# Altium project TurbineSpirometerV2.PrjPcb
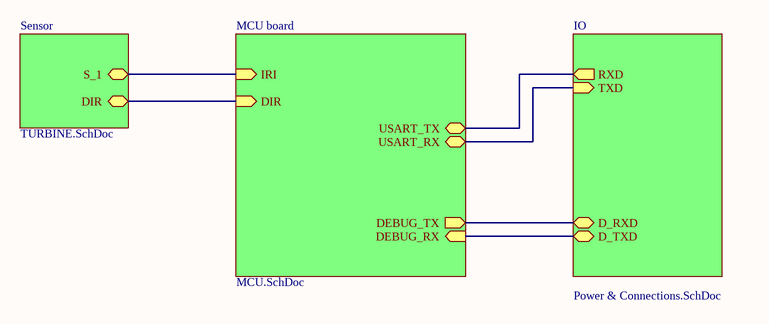
[diagram p0: Turbine_SM.SchDoc]
4 sheets, 52 parts. Net scope: hierarchical (ports join the sheet entries above them; power ports are global).
Board file: MCU.PcbDoc
Sheets:
  Turbine_SM.SchDoc
    Sensor = TURBINE.SchDoc
    MCU board = MCU.SchDoc
    IO = Power & Connections.SchDoc

## Sheet Turbine_SM.SchDoc
size A4

### Sub-sheets
IO = Power & Connections.SchDoc: TXD (in), RXD (out), D_RXD, D_TXD
MCU board = MCU.SchDoc: IRI (in), DIR (in), DEBUG_TX (out), DEBUG_RX (in), USART_TX, USART_RX
Sensor = TURBINE.SchDoc: S_1, DIR

### Nets
NetC3_1: sheet Sensor/S_1, sheet MCU board/IRI
NetJ1_1: sheet MCU board/DEBUG_RX, sheet IO/D_TXD
NetJ1_2: sheet MCU board/DEBUG_TX, sheet IO/D_RXD
NetU2_4: sheet Sensor/DIR, sheet MCU board/DIR
NetU3_30: sheet MCU board/USART_TX, sheet IO/RXD
NetU3_31: sheet MCU board/USART_RX, sheet IO/TXD

## Sheet TURBINE.SchDoc
size A4
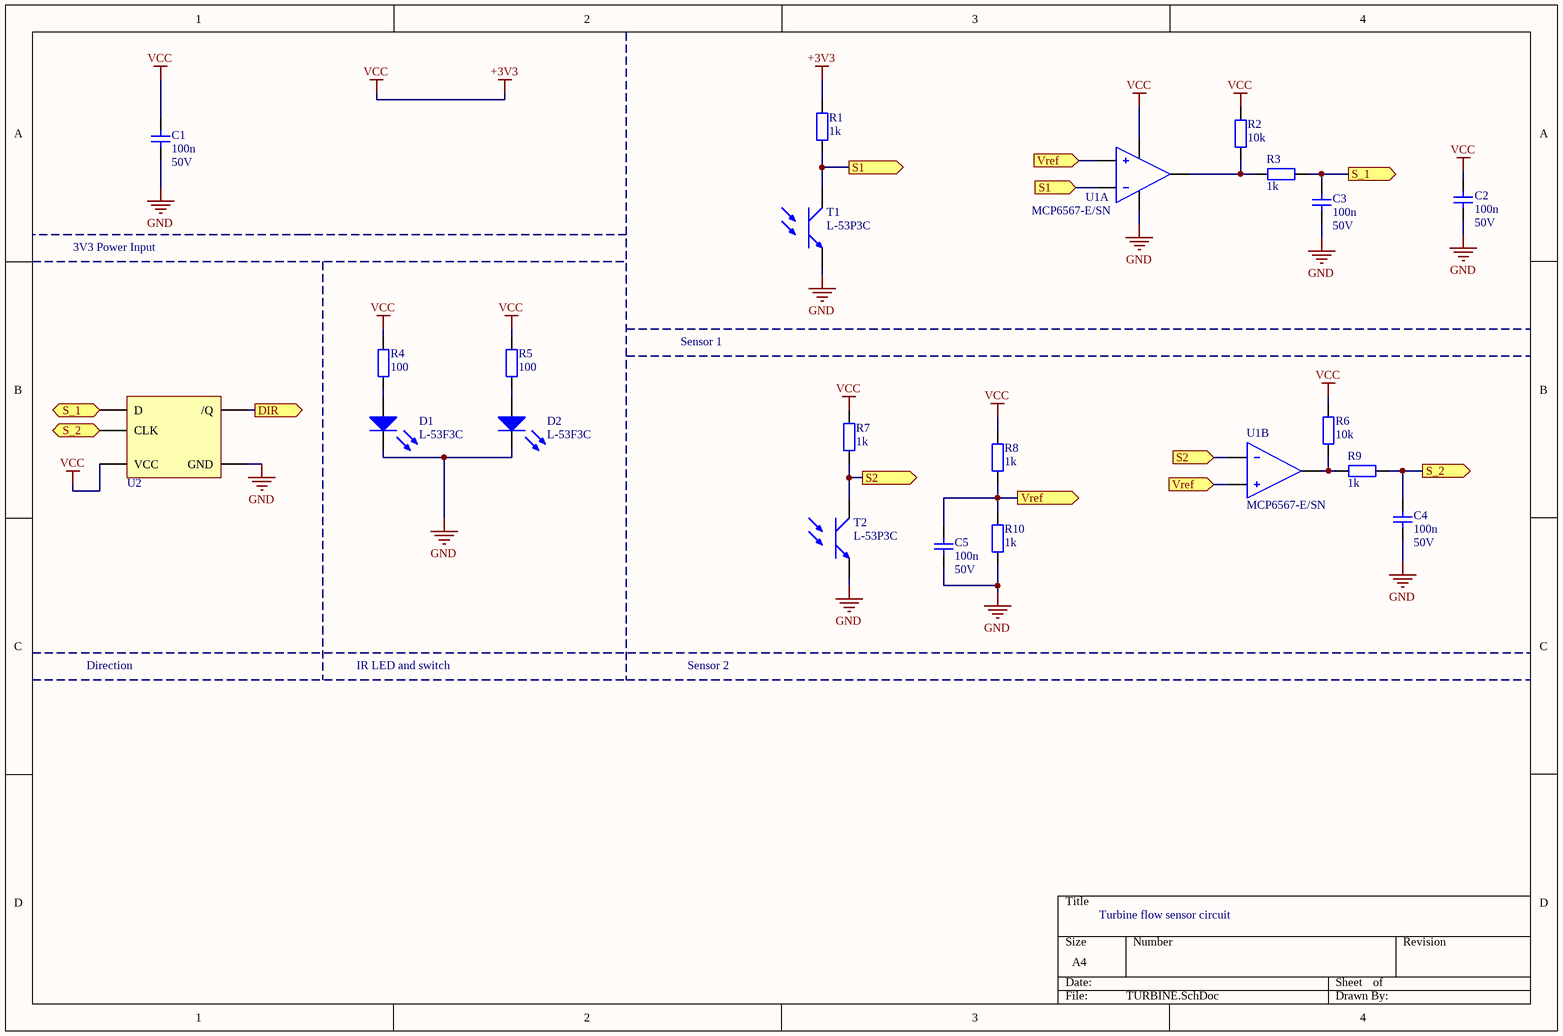
[diagram p1: TURBINE.SchDoc]

### Parts
C1  value 100n  Voltage Rating: 50V  [C1206]  (hidden comment: CAP)
C2  value 100n  Voltage Rating: 50V  [C1206]  (hidden comment: CAP)
C3  value 100n  Voltage Rating: 50V  [C1206]  (hidden comment: CAP)
C4  value 100n  Voltage Rating: 50V  [C1206]  (hidden comment: CAP)
C5  value 100n  Voltage Rating: 50V  [C1206]  (hidden comment: CAP)
D1  L-53F3C  [5mm LED]
D2  L-53F3C  [5mm LED]
R1  value 1k  [R1206]  (hidden comment: 1206)
R2  value 10k  [R1206]  (hidden comment: 1206)
R3  value 1k  [R1206]  (hidden comment: 1206)
R4  value 100  [R1206]  (hidden comment: 1206)
R5  value 100  [R1206]  (hidden comment: 1206)
R6  value 10k  [R1206]  (hidden comment: 1206)
R7  value 1k  [R1206]  (hidden comment: 1206)
R8  value 1k  [R1206]  (hidden comment: 1206)
R9  value 1k  [R1206]  (hidden comment: 1206)
R10  value 1k  [R1206]  (hidden comment: 1206)
T1  L-53P3C  [5mm LED]
T2  L-53P3C  [5mm LED]
U1  MCP6567-E/SN  [SOIC8]  (parts A,B of 2)
U2  SN74AUP1G80DCKR  [SOT23-5]  (value not drawn)

### Ports
DIR (out), S1 (in), S1 (out), S2 (in), S2 (out), S_1 (in), S_1 (out), S_2 (in), S_2 (out), Vref (in), Vref (out)

### Nets
+3V3: C1.1 C2.1 R1.1 R2.1 R4.1 R5.1 R6.1 R7.1 R8.1 U1.8(VCC) U2.5(VCC)  [also labelled VCC]
GND: C1.2 C2.2 C3.2 C4.2 C5.1 D1.1 D2.1 R10.2 T1.2(E) T2.2(E) U1.4(VSS) U2.3(GND)
NetC3_1: C3.1 R3.2 U2.1(D) ; port S_1
NetC4_1: C4.1 R9.2 U2.2(CLK) ; port S_2
NetC5_2: C5.2 R8.2 R10.1 U1.3(INA+) U1.5(INB+) ; port Vref
NetD1_2: D1.2 R4.2
NetD2_2: D2.2 R5.2
NetR1_2: R1.2 T1.1(C) U1.2(INA-) ; port S1
NetR2_2: R2.2 R3.1 U1.1(VoutA)
NetR6_2: R6.2 R9.1 U1.7(VoutB)
NetR7_2: R7.2 T2.1(C) U1.6(INB-) ; port S2
NetU2_4: U2.4(/Q) ; port DIR

### Notes on the sheet
- 3V3 Power Input
- Sensor 1
- Direction
- IR LED and switch
- Sensor 2
- Turbine flow sensor circuit

### Library data of the parts
C1-C5 = CAP: Capacitor
D1 D2 = L-53F3C: L-53F3C- IR EMITTING DIODE, 940NM, 5MM; Manufacturer: KINGBRIGHT; Forward Current If(AV): 20; Viewing Angle: 20°; Forward Voltage VF Max: 1.6; Diode Case Style: T-1 3/4 (5; SVHC: No SVHC (15-Jun-2015); No. of Pins: 2; Peak Wavelength: 940; Radiant Intensity: 30mW/Sr<!--FANDB--><div class="features-and-benefits-container"><div class="features-and-benefits-description"><span class="features-benefits-value">The L-53F3C is a 5; Supplier 1: Farnell; Manufacturer Part Number: L-53F3C; RoHS: YES; Stock 1: 8681; Pricing 1: 1=42,58, 10=39,924, 50=37,226, 100=34,359, 250=32,378, 500=27,867, 2000=24,452, 5000=22,007 (EUR); Rise Time: -; Fall Time tf: -; Operating Temperature Min: -40; Operating Temperature Max: 85; Packaging: Each; MSL: -; Operating Temperature Range: -40°C to +85; ComponentLink1URL: http://www.farnell.com/datasheets/1683593.pdf; ComponentLink1Description: http://www.farnell.com/datasheets/1683593.pdf; Supplier Part Number 1: 2290441
R1-R10 = RES: 1206 Resistor
T1 T2 = L-53P3C: L-53P3C- PHOTO TRANSISTOR, NPN 5mm; Manufacturer: KINGBRIGHT; Wavelength Typ: 940; Power Consumption: 100; Transistor Case Style: T-1 3/4 (5; No. of Pins: 2; SVHC: No SVHC (15-Jun-2015); Transistor Polarity: NPN<!--FANDB--><div class="features-and-benefits-container"><div class="features-and-benefits-description"><span class="features-benefits-value">The L-53P3C is a 5mm Phototransistor. It is made of NPN silicon. This phototransistor supports 940; Supplier 1: Farnell; Manufacturer Part Number: L-53P3C; RoHS: YES; Stock 1: 8919; Pricing 1: 1=42,58, 10=39,924, 50=37,226, 100=34,359, 250=32,378, 500=27,867, 2000=24,452, 5000=22,007 (EUR); Viewing Angle: -; Packaging: Each; MSL: -; ComponentLink1URL: http://www.farnell.com/datasheets/1683594.pdf; ComponentLink1Description: http://www.farnell.com/datasheets/1683594.pdf; Supplier Part Number 1: 2290444
U1 = MCP6567-E/SN: MICROCHIP - MCP6567-E/SN - IC, COMPARATOR, DUAL, 1.8V, 8SOIC; Comparator Type: High Speed; No. of Comparators: 2; Response Time: 56; Supply Voltage Range: 1.8V to 5.5; Comparator Case Style: SOIC; No. of Pins: 8; IC Output Type: CMOS, MOS, Open Collector, Open Drain, TTL; SVHC: No SVHC (17-Dec-2014); Approval Category: AEC-Q100; Output Compatibility: CMOS; Supply Current: 100; Supplier 1: Farnell; Manufacturer: MICROCHIP; Manufacturer Part Number: MCP6567-E/SN; RoHS: YES; Stock 1: 827; Pricing 1: 1=220,067, 10=215,008, 100=210,792 (EUR); Operating Temperature Min: -40; Operating Temperature Max: 125; Packaging: Each; MSL: MSL 1 - Unlimited; Amplifier Case Style: SOIC; Termination Type: SMD<!--FANDB--><div class="features-and-benefits-container"></div>; ComponentLink1URL: http://www.farnell.com/datasheets/1791050.pdf; ComponentLink1Description: http://www.farnell.com/datasheets/1791050.pdf
U2 = SN74AUP1G80DCKR: TEXAS INSTRUMENTS - SN74AUP1G80DCKR - FLIP FLOP, D-TYPE, 280MHZ, SC-70-5; Supplier 1: Farnell; Manufacturer: TEXAS INSTRUMENTS; Manufacturer Part Number: SN74AUP1G80DCKR; RoHS: YES; Stock 1: 5995; Pricing 1: 3000=77,993, 15000=69,983, 30000=66,61 (EUR); ComponentLink1URL: http://www.farnell.com/datasheets/1888920.pdf; ComponentLink1Description: http://www.farnell.com/datasheets/1888920.pdf; Supplier Part Number 1: 2436894

## Sheet MCU.SchDoc
size A4
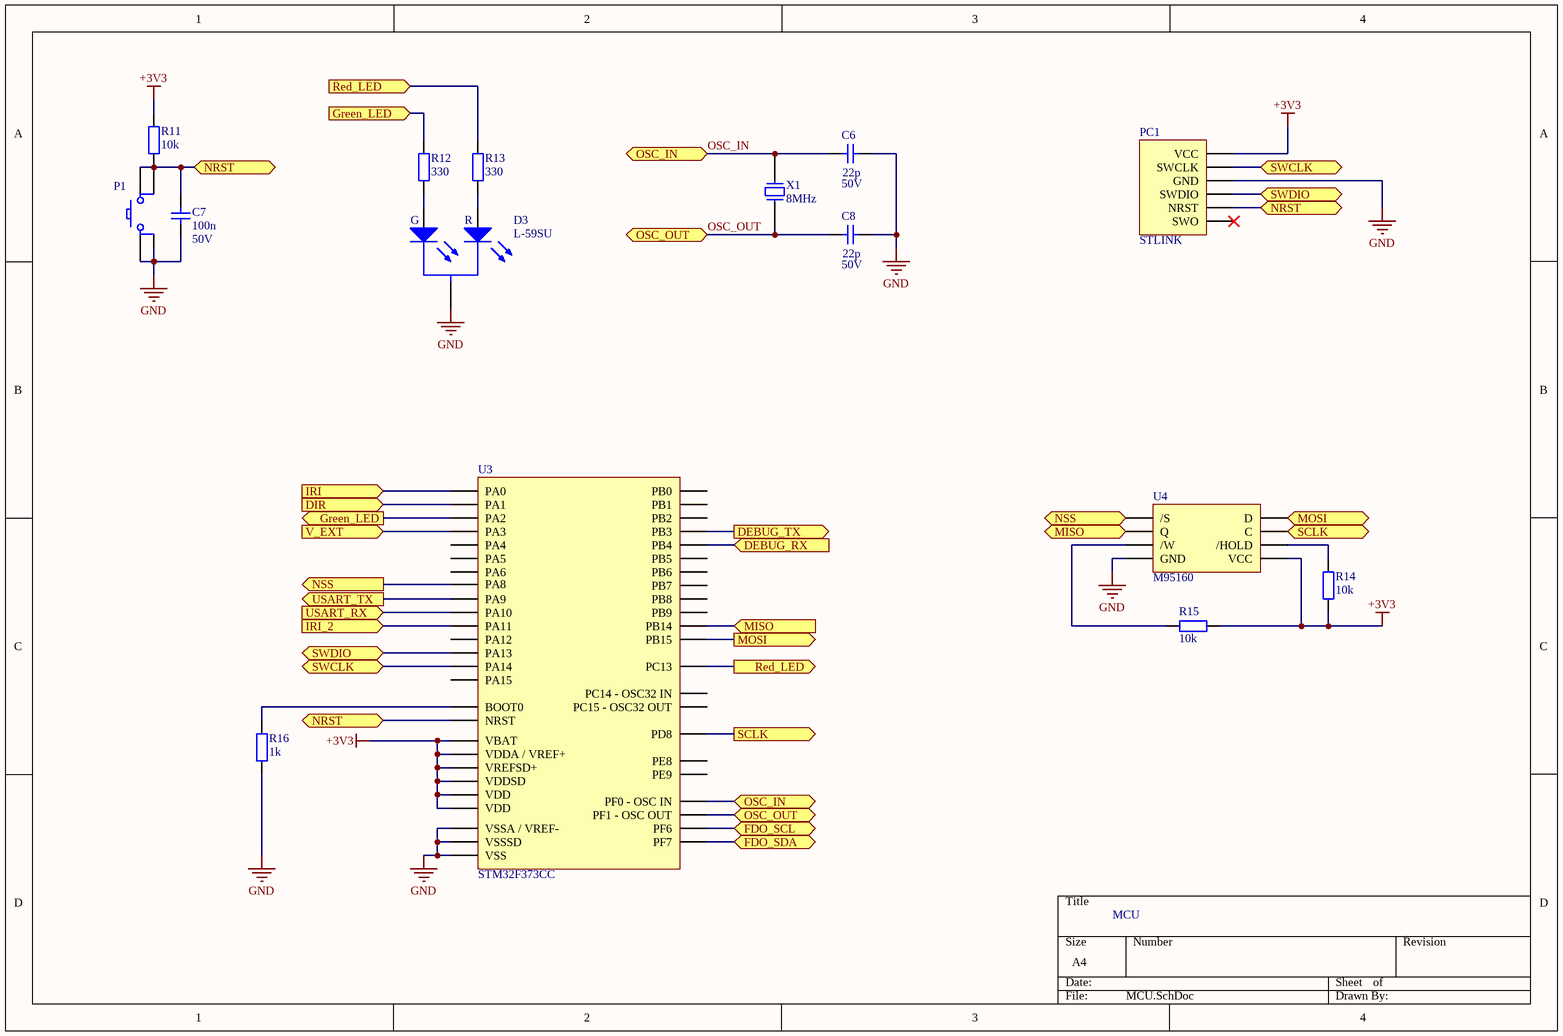
[diagram p2: MCU.SchDoc]

### Parts
C6  value 22p  Voltage Rating: 50V  [C1206]  (hidden comment: CAP)
C7  value 100n  Voltage Rating: 50V  [C1206]  (hidden comment: CAP)
C8  value 22p  Voltage Rating: 50V  [C1206]  (hidden comment: CAP)
D3  L-59SU  [5mmLEDBiCol]
P1  BTN  [PBUTTON]  (value not drawn)
PC1  STLINK  [SWD]
R11  value 10k  [R1206]  (hidden comment: 1206)
R12  value 330  [R1206]  (hidden comment: 1206)
R13  value 330  [R1206]  (hidden comment: 1206)
R14  value 10k  [R1206]  (hidden comment: 1206)
R15  value 10k  [R1206]  (hidden comment: 1206)
R16  value 1k  [R1206]  (hidden comment: 1206)
U3  STM32F373CC  [LQFP48]
U4  M95160  [SOIC8]
X1  value 8MHz  [HC49]  (hidden comment: XTAL)

### Ports
DEBUG_RX (in), DEBUG_TX (out), DIR (in), FDO_SCL (bidir), FDO_SDA (bidir), Green_LED (in), Green_LED (out), IRI (in), IRI_2 (in), MISO (in), MISO (out), MOSI (in), MOSI (out), NRST (bidir), NSS (in), NSS (out), OSC_IN, OSC_OUT, Red_LED (in), Red_LED (out), SCLK (in), SCLK (out), SWCLK (bidir), SWDIO (bidir), USART_RX (in), USART_TX (out), V_EXT (in)

### Nets
+3V3: PC1.1(VCC) R11.1 R14.1 R15.2 U3.1(VBAT) U3.9(VDDA_/_VREF+) U3.17(VDD) U3.24(VDDSD) U3.25(VREFSD+) U3.48(VDD) U4.8(VCC)
GND: C6.1 C7.2 C8.1 D3.2 P1.4 PC1.3(GND) R16.2 U3.8(VSSA_/_VREF-) U3.23(VSSSD) U3.47(VSS) U4.4(GND)
OSC_IN: C6.2 U3.5(PF0_-_OSC_IN) X1.1 ; port OSC_IN
OSC_OUT: C8.2 U3.6(PF1_-_OSC_OUT) X1.2 ; port OSC_OUT
NetC3_1: U3.10(PA0) ; port IRI
NetC7_1: C7.1 P1.1 P1.2 PC1.5(NRST) R11.2 U3.7(NRST) ; port NRST
NetD3_1: D3.1 R13.2
NetD3_3: D3.3 R12.2
NetJ1_1: U3.40(PB4) ; port DEBUG_RX
NetJ1_2: U3.39(PB3) ; port DEBUG_TX
NetPC1_2: PC1.2(SWCLK) U3.37(PA14) ; port SWCLK
NetPC1_4: PC1.4(SWDIO) U3.34(PA13) ; port SWDIO
NetR12_1: R12.1 U3.12(PA2) ; port Green_LED
NetR13_1: R13.1 U3.2(PC13) ; port Red_LED
NetR14_2: R14.2 U4.7(/HOLD)
NetR15_1: R15.1 U4.3(/W)
NetR16_1: R16.1 U3.44(BOOT0)
NetU2_4: U3.11(PA1) ; port DIR
NetU3_13: U3.13(PA3) ; port V_EXT
NetU3_26: U3.26(PB14) U4.2(Q) ; port MISO
NetU3_27: U3.27(PB15) U4.5(D) ; port MOSI
NetU3_28: U3.28(PD8) U4.6(C) ; port SCLK
NetU3_29: U3.29(PA8) U4.1(/S) ; port NSS
NetU3_30: U3.30(PA9) ; port USART_TX
NetU3_31: U3.31(PA10) ; port USART_RX
NetU3_32: U3.32(PA11) ; port IRI_2
NetU3_35: U3.35(PF6) ; port FDO_SCL
NetU3_36: U3.36(PF7) ; port FDO_SDA

Not connected (* = marked no-connect by the designer): P1 3; PC1 6(SWO)*; U3 3(PC14_-_OSC32_IN) 4(PC15_-_OSC32_OUT) 14(PA4) 15(PA5) 16(PA6) 18(PB0) 19(PB1) 20(PB2) 21(PE8) 22(PE9) 33(PA12) 38(PA15) 41(PB5) 42(PB6) 43(PB7) 45(PB8) 46(PB9)

### Notes on the sheet
- MCU
- (in symbol L-59SU) G; R

### Library data of the parts
C6-C8 = CAP: Capacitor
D3 = L-59SU: RED/GRE BICOL; Manufacturer: KINGBRIGHT; Manufacturer Part Number: L-59SURKCGKC
P1 = BTN: Push Button
PC1 = STLINK: STLINK programming tool connector
R11-R16 = RES: 1206 Resistor
U4 = M95160: SPI Flash Memory 16kbit
X1 = XTAL: Quartz Crystal

## Sheet Power & Connections.SchDoc
size A4
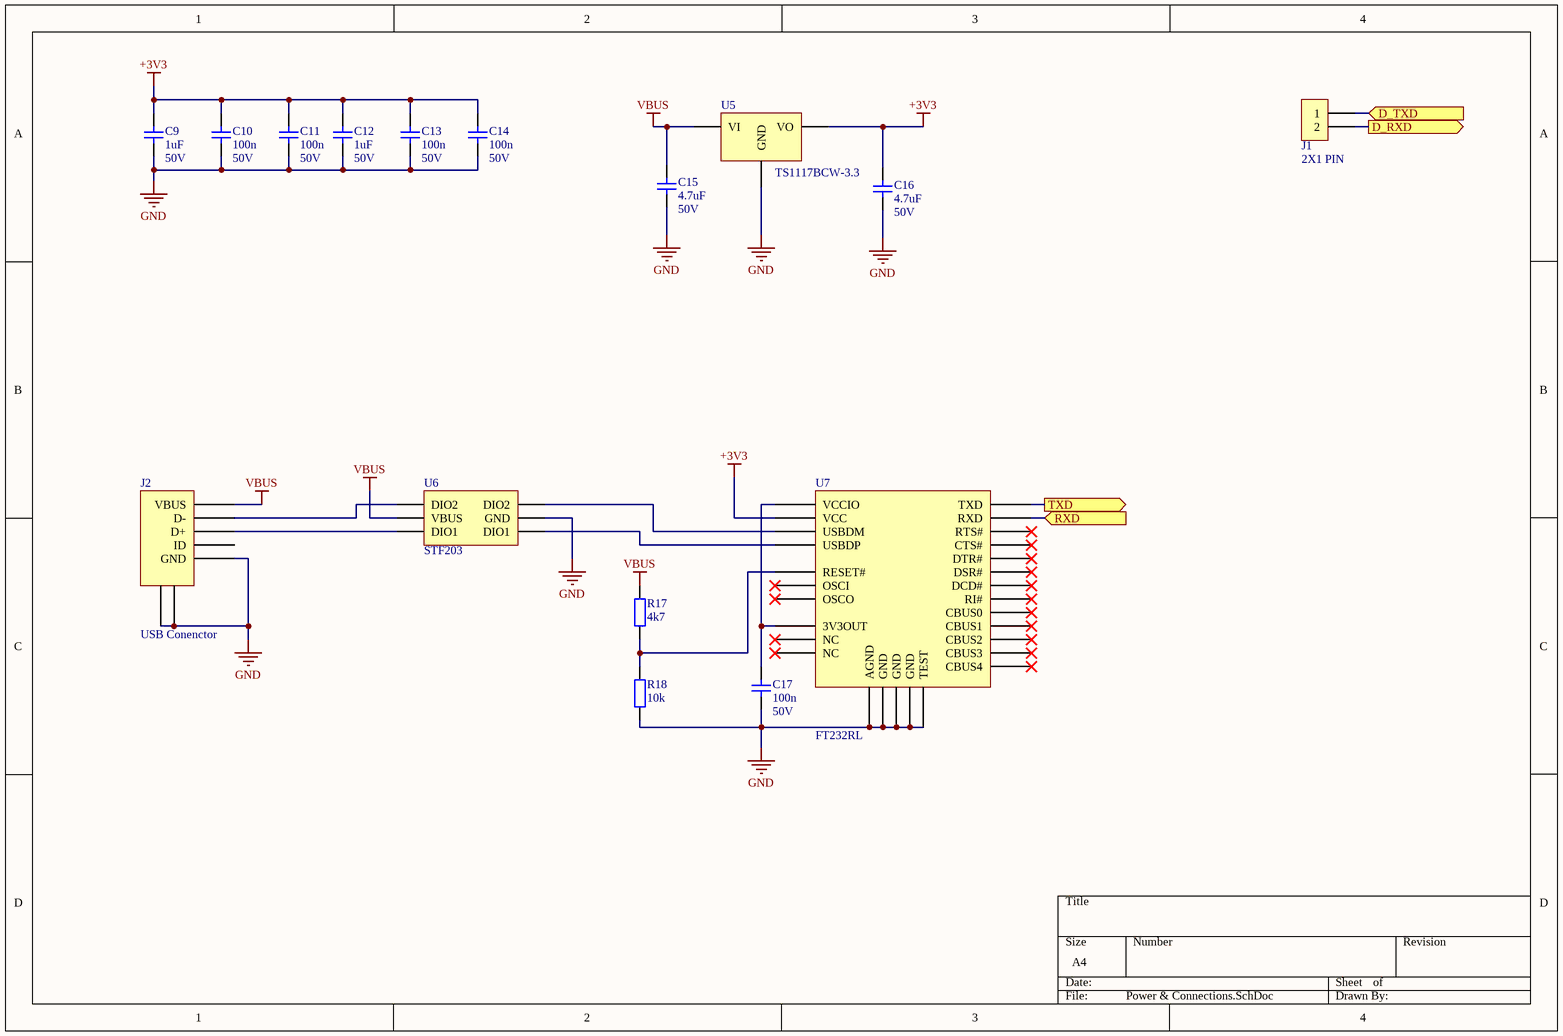
[diagram p3: Power & Connections.SchDoc]

### Parts
C9  value 1uF  Voltage Rating: 50V  [C1206]  (hidden comment: CAP)
C10  value 100n  Voltage Rating: 50V  [C1206]  (hidden comment: CAP)
C11  value 100n  Voltage Rating: 50V  [C1206]  (hidden comment: CAP)
C12  value 1uF  Voltage Rating: 50V  [C1206]  (hidden comment: CAP)
C13  value 100n  Voltage Rating: 50V  [C1206]  (hidden comment: CAP)
C14  value 100n  Voltage Rating: 50V  [C1206]  (hidden comment: CAP)
C15  value 4.7uF  Voltage Rating: 50V  [C1206]  (hidden comment: CAP)
C16  value 4.7uF  Voltage Rating: 50V  [C1206]  (hidden comment: CAP)
C17  value 100n  Voltage Rating: 50V  [C1206]  (hidden comment: CAP)
J1  2X1 PIN  [2X1PINHEAD]
J2  USB Conenctor  [USB_MINI]
R17  value 4k7  [R1206]  (hidden comment: 1206)
R18  value 10k  [R1206]  (hidden comment: 1206)
U5  TS1117BCW-3.3  [SOT-223]
U6  STF203  [SOT23-6]
U7  FT232RL  [SSOP28]

### Ports
D_RXD (out), D_TXD (in), RXD (in), TXD (out)

### Nets
+3V3: C9.1 C10.1 C11.1 C12.1 C13.1 C14.1 C16.1 U5.2(VO) U7.20(VCC)
GND: C9.2 C10.2 C11.2 C12.2 C13.2 C14.2 C15.2 C16.2 C17.2 J2.5(GND) J2.6(SHIELD) J2.7(SHIELD) R18.2 U5.1(GND) U6.2(GND) U7.7(GND) U7.18(GND) U7.21(GND) U7.25(AGND) U7.26(TEST)
VBUS: C15.1 J2.1(VBUS) R17.1 U5.3(VI) U6.5(VBUS)
NetC17_1: C17.1 U7.4(VCCIO) U7.17(3V3OUT)
NetJ1_1: J1.1 ; port D_TXD
NetJ1_2: J1.2 ; port D_RXD
NetJ2_2: J2.2(D-) U6.4(DIO2)
NetJ2_3: J2.3(D+) U6.6(DIO1)
NetR17_2: R17.2 R18.1 U7.19(RESET#)
NetU3_30: U7.5(RXD) ; port RXD
NetU3_31: U7.1(TXD) ; port TXD
NetU6_1: U6.1(DIO1) U7.15(USBDP)
NetU6_3: U6.3(DIO2) U7.16(USBDM)

Not connected (* = marked no-connect by the designer): J2 4(ID); U7 2(DTR#)* 3(RTS#)* 6(RI#)* 8(NC)* 9(DSR#)* 10(DCD#)* 11(CTS#)* 12(CBUS4)* 13(CBUS2)* 14(CBUS3)* 22(CBUS1)* 23(CBUS0)* 24(NC)* 27(OSCI)* 28(OSCO)*

### Library data of the parts
C9-C17 = CAP: Capacitor
J1 = 2X1 PIN: Pin Header 2x1
J2 = USB: USB connector
R17 R18 = RES: 1206 Resistor
U5 = TS1117BCW-3.3: TAIWAN SEMICONDUCTOR - TS1117BCW-3.3 - LDO VOLTAGE REG, 0.8A, 12V, SOT223-3; Supplier 1: Farnell; Manufacturer: TAIWAN SEMICONDUCTOR; Manufacturer Part Number: TS1117BCW-3.3; RoHS: YES; Stock 1: 3747; Pricing 1: 1=364,249, 10=186,762, 100=105,396, 300=94,013, 700=83,052, 2000=51,012, 7000=48,904, 20000=48,482 (EUR); ComponentLink1URL: http://www.farnell.com/datasheets/1766208.pdf; ComponentLink1Description: http://www.farnell.com/datasheets/1766208.pdf; Supplier Part Number 1: 7208359
U6 = STF203: STF203 - IC, FILTER, USB, ESD PROTECT, SOT236
U7 = FT232RL: USB-UART Bridge FTDI device; Manufacturer Part Number: FT232RL-REEL; Bridge Type: USB to UART; Supply Voltage Min: 1.8; Supply Voltage Max: 5.25; Interface Case Style: SSOP; No. of Pins: 28; SVHC: No SVHC (15-Jun-2015); Supply Voltage Range: 1.8V to 5.25V, 3.3V to 5.25V<!--FANDB--><div class="features-and-benefits-container"><div class="features-and-benefits-description"><span class="features-benefits-value">The FT232R is the latest device to be added to FTDI's range of USB UART interface Integrated Circuit Devices. The FT232R is a USB to serial UART interface with optional clock generator output, and the new FTDIChip-ID security dongle feature. In addition, asynchronous and synchronous bit bang interface modes are available. USB to serial designs using the FT232R have been further simplified by fully integrating the external EEPROM, clock circuit and USB resistors onto the device.</span></div><div class="features-and-benefits-list"><ul class="features-and-benefits-list-list"><li class="features-and-benefits-list-item">Single chip USB to asynchronous serial data transfer interface</li><li class="features-and-benefits-list-item">Entire USB protocol handled on the chip - No USB-specific firmware programming required</li><li class="features-and-benefits-list-item">UART interface support for 7 or 8 data bits, 1 or 2 stop bits & odd/even/mark/space/no parity</li><li class="features-and-benefits-list-item">Fully assisted hardware or X-On / X-Off software handshaking</li><li class="features-and-benefits-list-item">In-built support for event characters and line break condition</li><li class="features-and-benefits-list-item">New USB FTDIChip-ID feature</li><li class="features-and-benefits-list-item">New configurable CBUS I/O pins</li><li class="features-and-benefits-list-item">Auto transmit buffer control for RS485 applications</li><li class="features-and-benefits-list-item">Transmit and receive LED drive signals</li><li class="features-and-benefits-list-item">New 48MHz, 24MHz,12MHz, and 6; Supplier 1: Farnell; Manufacturer: FTDI; RoHS: YES; Stock 1: 222260; Pricing 1: 1=1260,536, 10=1163,572, 50=1108,766, 100=1049,744, 250=935,916, 500=817,873, 1000=678,75 (EUR); Operating Temperature Min: -40; Operating Temperature Max: 85; Packaging: Cut Tape; MSL: MSL 3 - 168 hours; Operating Temperature Range: -40°C to +85; ComponentLink1URL: http://www.farnell.com/datasheets/1647396.pdf; ComponentLink1Description: http://www.farnell.com/datasheets/1647396.pdf; Supplier Part Number 1: 1146032

## Nets that join several sheets
+3V3: TURBINE (11 pins), MCU (11 pins), Power & Connections (9 pins)
GND: TURBINE (12 pins), MCU (11 pins), Power & Connections (20 pins)
NetC3_1: TURBINE (C3.1 R3.2 U2.1), MCU (U3.10)
NetJ1_1: MCU (U3.40), Power & Connections (J1.1)
NetJ1_2: MCU (U3.39), Power & Connections (J1.2)
NetU2_4: TURBINE (U2.4), MCU (U3.11)
NetU3_30: MCU (U3.30), Power & Connections (U7.5)
NetU3_31: MCU (U3.31), Power & Connections (U7.1)